# Altium project 2015_CONNECTEUR_BALISE.PrjPcb
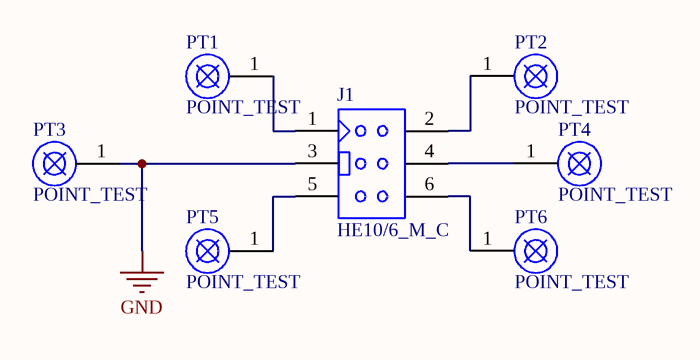
[diagram p0: 2015_CONNECTEUR_BALISE.SchDoc]
1 sheet, 7 parts. Net scope: global (net labels, ports and power ports of the same name join across sheets).
Board file: 2015_CONNECTEUR_BALISE.PcbDoc

## Sheet 2015_CONNECTEUR_BALISE.SchDoc
size A4

### Parts
J1  HE10/6_MALE_COUDE  [HE10/6_M_C]  (value not drawn)
PT1  POINT_TEST  [POINT_TEST]
PT2  POINT_TEST  [POINT_TEST]
PT3  POINT_TEST  [POINT_TEST]
PT4  POINT_TEST  [POINT_TEST]
PT5  POINT_TEST  [POINT_TEST]
PT6  POINT_TEST  [POINT_TEST]

### Nets
GND: J1.3 PT3.1
NetJ1_1: J1.1 PT1.1
NetJ1_2: J1.2 PT2.1
NetJ1_4: J1.4 PT4.1
NetJ1_5: J1.5 PT5.1
NetJ1_6: J1.6 PT6.1

### Notes on the sheet
- Title
- Size:
- Date:
- A4
- Number:
- Time:
- Revision:
- Sheet
- of
- File:

### Library data of the parts
J1 = HE10/6_MALE_COUDE: EMBASE HE10/6 MALE COUDE; Type: HE10/6_M_C
PT1-PT6 = POINT_TEST: POINT TEST